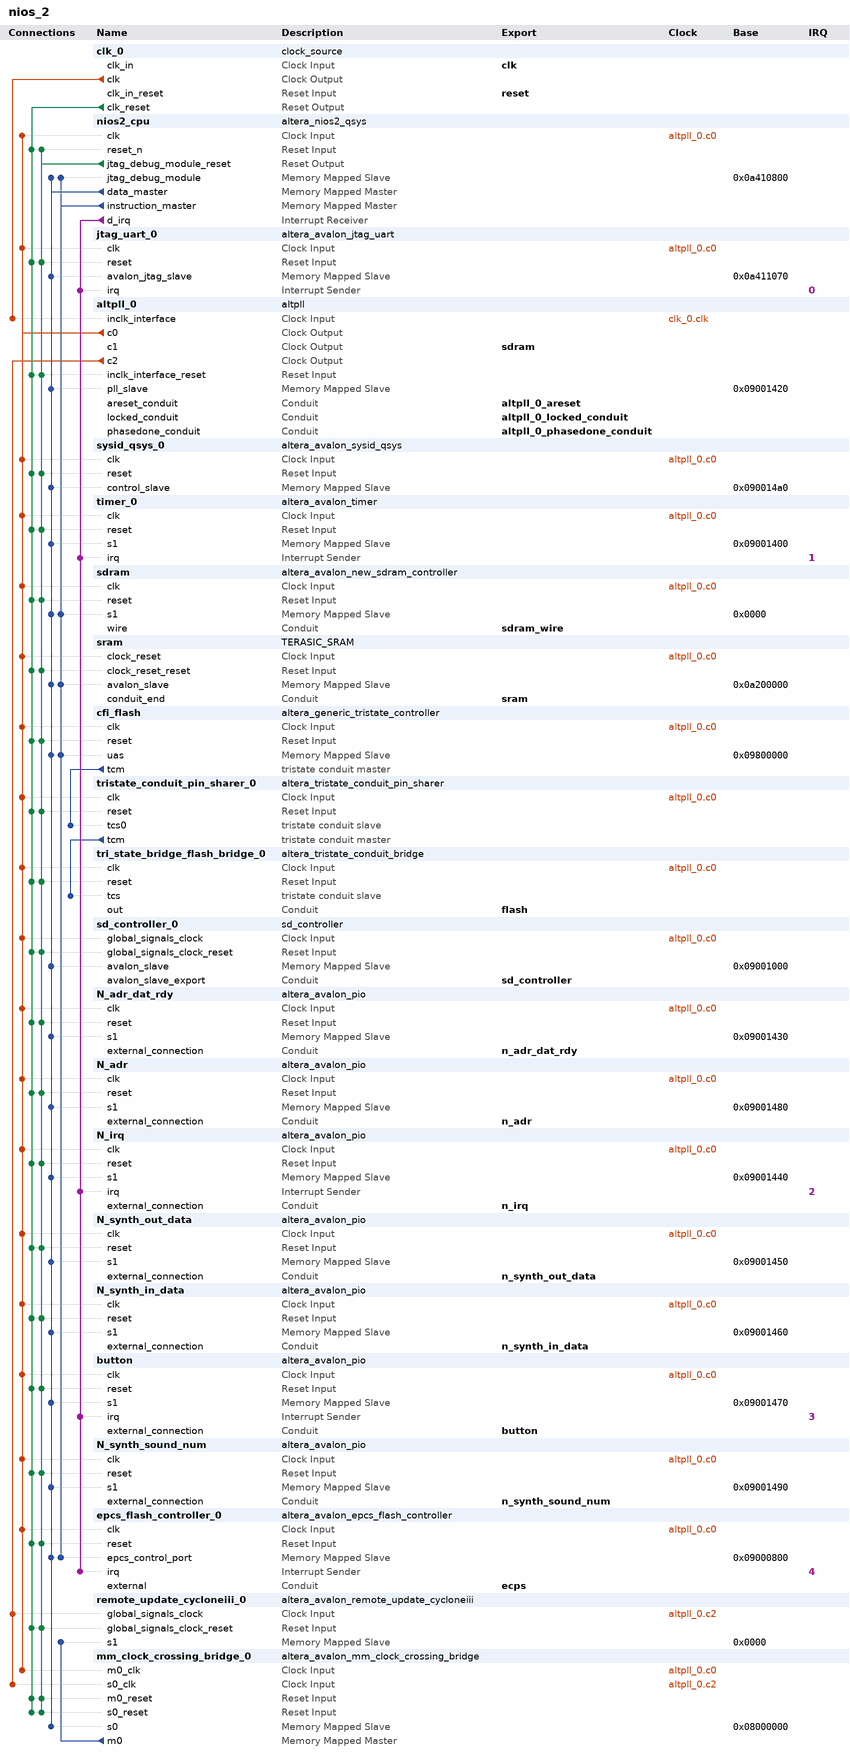
[diagram p0: system contents]
# Platform Designer (Qsys) system nios_2
# Parameters at their usual value, and those the tool derives, are not listed.
package require -exact qsys 11.1
create_system nios_2
set_project_property DEVICE_FAMILY CYCLONEIVE

add_instance clk_0 clock_source 11.1
set_instance_parameter_value clk_0 clockFrequency 50000000

add_instance nios2_cpu altera_nios2_qsys 11.1
set_instance_parameter_value nios2_cpu manuallyAssignCpuID false
set_instance_parameter_value nios2_cpu resetSlave epcs_flash_controller_0.epcs_control_port
set_instance_parameter_value nios2_cpu exceptionSlave sdram.s1
set_instance_parameter_value nios2_cpu breakSlave nios2_cpu.jtag_debug_module
set_instance_parameter_value nios2_cpu impl Fast
set_instance_parameter_value nios2_cpu icache_size 4096

add_instance jtag_uart_0 altera_avalon_jtag_uart 11.1
set_instance_parameter_value jtag_uart_0 simInteractiveOptions INTERACTIVE_ASCII_OUTPUT

add_instance altpll_0 altpll 11.1
set_instance_parameter_value altpll_0 INCLK0_INPUT_FREQUENCY 20000
set_instance_parameter_value altpll_0 CLK0_MULTIPLY_BY 2
set_instance_parameter_value altpll_0 CLK1_MULTIPLY_BY 2
set_instance_parameter_value altpll_0 CLK2_MULTIPLY_BY 4
set_instance_parameter_value altpll_0 CLK0_DIVIDE_BY 1
set_instance_parameter_value altpll_0 CLK1_DIVIDE_BY 1
set_instance_parameter_value altpll_0 CLK2_DIVIDE_BY 5
set_instance_parameter_value altpll_0 CLK1_PHASE_SHIFT -1806
set_instance_parameter_value altpll_0 CLK2_PHASE_SHIFT 0
set_instance_parameter_value altpll_0 CLK1_DUTY_CYCLE 50
set_instance_parameter_value altpll_0 CLK2_DUTY_CYCLE 50
set_instance_parameter_value altpll_0 PORT_clk1 PORT_USED
set_instance_parameter_value altpll_0 PORT_clk2 PORT_USED
set_instance_parameter_value altpll_0 PORT_clk3 PORT_UNUSED
set_instance_parameter_value altpll_0 PORT_ARESET PORT_UNUSED
set_instance_parameter_value altpll_0 PORT_LOCKED PORT_UNUSED

add_instance sysid_qsys_0 altera_avalon_sysid_qsys 11.1
set_instance_parameter_value sysid_qsys_0 id 11

add_instance timer_0 altera_avalon_timer 11.1
set_instance_parameter_value timer_0 period 10
set_instance_parameter_value timer_0 periodUnits MSEC
set_instance_parameter_value timer_0 timerPreset FULL_FEATURED

add_instance sdram altera_avalon_new_sdram_controller 11.1
set_instance_parameter_value sdram TAC 5.5
set_instance_parameter_value sdram TRCD 20.0
set_instance_parameter_value sdram TRP 20.0
set_instance_parameter_value sdram casLatency 3
set_instance_parameter_value sdram columnWidth 10
set_instance_parameter_value sdram dataWidth 32
set_instance_parameter_value sdram generateSimulationModel true
set_instance_parameter_value sdram model custom
set_instance_parameter_value sdram numberOfBanks 4
set_instance_parameter_value sdram numberOfChipSelects 1
set_instance_parameter_value sdram powerUpDelay 100.0
set_instance_parameter_value sdram refreshPeriod 15.625
set_instance_parameter_value sdram rowWidth 13

add_instance sram TERASIC_SRAM 1.0
set_instance_parameter_value sram DATA_BITS 16
set_instance_parameter_value sram ADDR_BITS 20

add_instance cfi_flash altera_generic_tristate_controller 11.1
set_instance_parameter_value cfi_flash TCM_ADDRESS_W 23
set_instance_parameter_value cfi_flash TCM_DATA_W 8
set_instance_parameter_value cfi_flash TCM_BYTEENABLE_W 1
set_instance_parameter_value cfi_flash TCM_READ_WAIT 160
set_instance_parameter_value cfi_flash TCM_WRITE_WAIT 160
set_instance_parameter_value cfi_flash TCM_SETUP_WAIT 60
set_instance_parameter_value cfi_flash TCM_DATA_HOLD 60
set_instance_parameter_value cfi_flash TCM_MAX_PENDING_READ_TRANSACTIONS 3
set_instance_parameter_value cfi_flash TCM_TURNAROUND_TIME 2
set_instance_parameter_value cfi_flash TCM_TIMING_UNITS 0
set_instance_parameter_value cfi_flash TCM_READLATENCY 2
set_instance_parameter_value cfi_flash TCM_SYMBOLS_PER_WORD 1
set_instance_parameter_value cfi_flash USE_READ 1
set_instance_parameter_value cfi_flash USE_BEGINTRANSFER 0
set_instance_parameter_value cfi_flash USE_BYTEENABLE 0
set_instance_parameter_value cfi_flash USE_OUTPUTENABLE 0
set_instance_parameter_value cfi_flash ACTIVE_LOW_READ 1
set_instance_parameter_value cfi_flash ACTIVE_LOW_BYTEENABLE 0
set_instance_parameter_value cfi_flash ACTIVE_LOW_OUTPUTENABLE 0
set_instance_parameter_value cfi_flash ACTIVE_LOW_BEGINTRANSFER 0
set_instance_parameter_value cfi_flash CHIPSELECT_THROUGH_READLATENCY 0
set_instance_parameter_value cfi_flash MODULE_ASSIGNMENT_KEYS embeddedsw.configuration.hwClassnameDriverSupportList,embeddedsw.configuration.hwClassnameDriverSupportDefault,embeddedsw.CMacro.SETUP_VALUE,embeddedsw.CMacro.WAIT_VALUE,embeddedsw.CMacro.HOLD_VALUE,embeddedsw.CMacro.TIMING_UNITS,embeddedsw.CMacro.SIZE,embeddedsw.memoryInfo.MEM_INIT_DATA_WIDTH,embeddedsw.memoryInfo.HAS_BYTE_LANE,embeddedsw.memoryInfo.IS_FLASH,embeddedsw.memoryInfo.GENERATE_DAT_SYM,embeddedsw.memoryInfo.GENERATE_FLASH,embeddedsw.memoryInfo.DAT_SYM_INSTALL_DIR,embeddedsw.memoryInfo.FLASH_INSTALL_DIR
set_instance_parameter_value cfi_flash MODULE_ASSIGNMENT_VALUES altera_avalon_lan91c111:altera_avalon_cfi_flash,altera_avalon_cfi_flash,60,160,60,ns,8388608u,8,0,1,1,1,SIM_DIR,APP_DIR
set_instance_parameter_value cfi_flash INTERFACE_ASSIGNMENT_KEYS embeddedsw.configuration.isFlash,embeddedsw.configuration.isMemoryDevice,embeddedsw.configuration.isNonVolatileStorage
set_instance_parameter_value cfi_flash INTERFACE_ASSIGNMENT_VALUES 1,1,1

add_instance tristate_conduit_pin_sharer_0 altera_tristate_conduit_pin_sharer 11.1
set_instance_parameter_value tristate_conduit_pin_sharer_0 NUM_INTERFACES 1
set_instance_parameter_value tristate_conduit_pin_sharer_0 MODULE_ORIGIN_LIST cfi_flash.tcm,cfi_flash.tcm,cfi_flash.tcm,cfi_flash.tcm,cfi_flash.tcm
set_instance_parameter_value tristate_conduit_pin_sharer_0 SHARED_SIGNAL_LIST tri_state_bridge_flash_address,read_n_to_the_cfi_flash,write_n_to_the_cfi_flash,tri_state_bridge_flash_data,select_n_to_the_cfi_flash

add_instance tri_state_bridge_flash_bridge_0 altera_tristate_conduit_bridge 11.1

add_instance sd_controller_0 sd_controller 8.0
set_instance_parameter_value sd_controller_0 IDLE 0
set_instance_parameter_value sd_controller_0 SHIFT_OUT_CMD 1
set_instance_parameter_value sd_controller_0 WAIT_FOR_RSP_START 2
set_instance_parameter_value sd_controller_0 SHIFT_IN_CMD_RSP 3
set_instance_parameter_value sd_controller_0 WAIT_FOR_DATA_START 4
set_instance_parameter_value sd_controller_0 SHIFT_IN_DATA 5
set_instance_parameter_value sd_controller_0 SHIFT_IN_CRC16 6
set_instance_parameter_value sd_controller_0 SHIFT_OUT_DATA_TOKEN 7
set_instance_parameter_value sd_controller_0 SHIFT_OUT_DATA 8
set_instance_parameter_value sd_controller_0 SHIFT_OUT_CRC16 9
set_instance_parameter_value sd_controller_0 SHIFT_IN_DATA_RSP 10
set_instance_parameter_value sd_controller_0 DATA_BUSY 11
set_instance_parameter_value sd_controller_0 ERROR_STATE 12
set_instance_parameter_value sd_controller_0 WAITS 13

add_instance N_adr_dat_rdy altera_avalon_pio 11.1
set_instance_parameter_value N_adr_dat_rdy direction Output
set_instance_parameter_value N_adr_dat_rdy width 3

add_instance N_adr altera_avalon_pio 11.1
set_instance_parameter_value N_adr direction Output
set_instance_parameter_value N_adr width 10

add_instance N_irq altera_avalon_pio 11.1
set_instance_parameter_value N_irq captureEdge true
set_instance_parameter_value N_irq direction Input
set_instance_parameter_value N_irq generateIRQ true
set_instance_parameter_value N_irq irqType EDGE
set_instance_parameter_value N_irq width 2

add_instance N_synth_out_data altera_avalon_pio 11.1
set_instance_parameter_value N_synth_out_data direction Input
set_instance_parameter_value N_synth_out_data width 8

add_instance N_synth_in_data altera_avalon_pio 11.1
set_instance_parameter_value N_synth_in_data direction Output
set_instance_parameter_value N_synth_in_data width 8

add_instance button altera_avalon_pio 11.1
set_instance_parameter_value button captureEdge true
set_instance_parameter_value button direction Input
set_instance_parameter_value button generateIRQ true
set_instance_parameter_value button irqType EDGE
set_instance_parameter_value button width 4

add_instance N_synth_sound_num altera_avalon_pio 11.1
set_instance_parameter_value N_synth_sound_num captureEdge true
set_instance_parameter_value N_synth_sound_num direction Input
set_instance_parameter_value N_synth_sound_num width 8

add_instance epcs_flash_controller_0 altera_avalon_epcs_flash_controller 11.1

add_instance remote_update_cycloneiii_0 altera_avalon_remote_update_cycloneiii 11.1
set_instance_parameter_value remote_update_cycloneiii_0 clockFrequency 40000000

add_instance mm_clock_crossing_bridge_0 altera_avalon_mm_clock_crossing_bridge 11.1
set_instance_parameter_value mm_clock_crossing_bridge_0 DATA_WIDTH 32
set_instance_parameter_value mm_clock_crossing_bridge_0 ADDRESS_WIDTH 10
set_instance_parameter_value mm_clock_crossing_bridge_0 MAX_BURST_SIZE 1
set_instance_parameter_value mm_clock_crossing_bridge_0 COMMAND_FIFO_DEPTH 4
set_instance_parameter_value mm_clock_crossing_bridge_0 RESPONSE_FIFO_DEPTH 4
set_instance_parameter_value mm_clock_crossing_bridge_0 MASTER_SYNC_DEPTH 2
set_instance_parameter_value mm_clock_crossing_bridge_0 SLAVE_SYNC_DEPTH 2

# connections
add_connection altpll_0.c0 button.clk clock
add_connection altpll_0.c0 cfi_flash.clk clock
add_connection altpll_0.c0 epcs_flash_controller_0.clk clock
add_connection altpll_0.c0 jtag_uart_0.clk clock
add_connection altpll_0.c0 mm_clock_crossing_bridge_0.m0_clk clock
add_connection altpll_0.c0 N_adr.clk clock
add_connection altpll_0.c0 N_adr_dat_rdy.clk clock
add_connection altpll_0.c0 N_irq.clk clock
add_connection altpll_0.c0 N_synth_in_data.clk clock
add_connection altpll_0.c0 N_synth_out_data.clk clock
add_connection altpll_0.c0 N_synth_sound_num.clk clock
add_connection altpll_0.c0 nios2_cpu.clk clock
add_connection altpll_0.c0 sd_controller_0.global_signals_clock clock
add_connection altpll_0.c0 sdram.clk clock
add_connection altpll_0.c0 sram.clock_reset clock
add_connection altpll_0.c0 sysid_qsys_0.clk clock
add_connection altpll_0.c0 timer_0.clk clock
add_connection altpll_0.c0 tri_state_bridge_flash_bridge_0.clk clock
add_connection altpll_0.c0 tristate_conduit_pin_sharer_0.clk clock
add_connection altpll_0.c2 mm_clock_crossing_bridge_0.s0_clk clock
add_connection altpll_0.c2 remote_update_cycloneiii_0.global_signals_clock clock
add_connection clk_0.clk altpll_0.inclk_interface clock
add_connection clk_0.clk_reset altpll_0.inclk_interface_reset reset
add_connection clk_0.clk_reset button.reset reset
add_connection clk_0.clk_reset cfi_flash.reset reset
add_connection clk_0.clk_reset epcs_flash_controller_0.reset reset
add_connection clk_0.clk_reset jtag_uart_0.reset reset
add_connection clk_0.clk_reset mm_clock_crossing_bridge_0.m0_reset reset
add_connection clk_0.clk_reset mm_clock_crossing_bridge_0.s0_reset reset
add_connection clk_0.clk_reset N_adr.reset reset
add_connection clk_0.clk_reset N_adr_dat_rdy.reset reset
add_connection clk_0.clk_reset N_irq.reset reset
add_connection clk_0.clk_reset N_synth_in_data.reset reset
add_connection clk_0.clk_reset N_synth_out_data.reset reset
add_connection clk_0.clk_reset N_synth_sound_num.reset reset
add_connection clk_0.clk_reset nios2_cpu.reset_n reset
add_connection clk_0.clk_reset remote_update_cycloneiii_0.global_signals_clock_reset reset
add_connection clk_0.clk_reset sd_controller_0.global_signals_clock_reset reset
add_connection clk_0.clk_reset sdram.reset reset
add_connection clk_0.clk_reset sram.clock_reset_reset reset
add_connection clk_0.clk_reset sysid_qsys_0.reset reset
add_connection clk_0.clk_reset timer_0.reset reset
add_connection clk_0.clk_reset tri_state_bridge_flash_bridge_0.reset reset
add_connection clk_0.clk_reset tristate_conduit_pin_sharer_0.reset reset
add_connection nios2_cpu.jtag_debug_module_reset altpll_0.inclk_interface_reset reset
add_connection nios2_cpu.jtag_debug_module_reset button.reset reset
add_connection nios2_cpu.jtag_debug_module_reset cfi_flash.reset reset
add_connection nios2_cpu.jtag_debug_module_reset epcs_flash_controller_0.reset reset
add_connection nios2_cpu.jtag_debug_module_reset jtag_uart_0.reset reset
add_connection nios2_cpu.jtag_debug_module_reset mm_clock_crossing_bridge_0.m0_reset reset
add_connection nios2_cpu.jtag_debug_module_reset mm_clock_crossing_bridge_0.s0_reset reset
add_connection nios2_cpu.jtag_debug_module_reset N_adr.reset reset
add_connection nios2_cpu.jtag_debug_module_reset N_adr_dat_rdy.reset reset
add_connection nios2_cpu.jtag_debug_module_reset N_irq.reset reset
add_connection nios2_cpu.jtag_debug_module_reset N_synth_in_data.reset reset
add_connection nios2_cpu.jtag_debug_module_reset N_synth_out_data.reset reset
add_connection nios2_cpu.jtag_debug_module_reset N_synth_sound_num.reset reset
add_connection nios2_cpu.jtag_debug_module_reset nios2_cpu.reset_n reset
add_connection nios2_cpu.jtag_debug_module_reset remote_update_cycloneiii_0.global_signals_clock_reset reset
add_connection nios2_cpu.jtag_debug_module_reset sd_controller_0.global_signals_clock_reset reset
add_connection nios2_cpu.jtag_debug_module_reset sdram.reset reset
add_connection nios2_cpu.jtag_debug_module_reset sram.clock_reset_reset reset
add_connection nios2_cpu.jtag_debug_module_reset sysid_qsys_0.reset reset
add_connection nios2_cpu.jtag_debug_module_reset timer_0.reset reset
add_connection nios2_cpu.jtag_debug_module_reset tri_state_bridge_flash_bridge_0.reset reset
add_connection nios2_cpu.jtag_debug_module_reset tristate_conduit_pin_sharer_0.reset reset
add_connection mm_clock_crossing_bridge_0.m0 remote_update_cycloneiii_0.s1 avalon
set_connection_parameter_value mm_clock_crossing_bridge_0.m0/remote_update_cycloneiii_0.s1 baseAddress 0x0000
add_connection nios2_cpu.data_master altpll_0.pll_slave avalon
set_connection_parameter_value nios2_cpu.data_master/altpll_0.pll_slave baseAddress 0x09001420
add_connection nios2_cpu.data_master button.s1 avalon
set_connection_parameter_value nios2_cpu.data_master/button.s1 baseAddress 0x09001470
add_connection nios2_cpu.data_master cfi_flash.uas avalon
set_connection_parameter_value nios2_cpu.data_master/cfi_flash.uas baseAddress 0x09800000
add_connection nios2_cpu.data_master epcs_flash_controller_0.epcs_control_port avalon
set_connection_parameter_value nios2_cpu.data_master/epcs_flash_controller_0.epcs_control_port baseAddress 0x09000800
add_connection nios2_cpu.data_master jtag_uart_0.avalon_jtag_slave avalon
set_connection_parameter_value nios2_cpu.data_master/jtag_uart_0.avalon_jtag_slave baseAddress 0x0a411070
add_connection nios2_cpu.data_master mm_clock_crossing_bridge_0.s0 avalon
set_connection_parameter_value nios2_cpu.data_master/mm_clock_crossing_bridge_0.s0 baseAddress 0x08000000
add_connection nios2_cpu.data_master N_adr.s1 avalon
set_connection_parameter_value nios2_cpu.data_master/N_adr.s1 baseAddress 0x09001480
add_connection nios2_cpu.data_master N_adr_dat_rdy.s1 avalon
set_connection_parameter_value nios2_cpu.data_master/N_adr_dat_rdy.s1 baseAddress 0x09001430
add_connection nios2_cpu.data_master N_irq.s1 avalon
set_connection_parameter_value nios2_cpu.data_master/N_irq.s1 baseAddress 0x09001440
add_connection nios2_cpu.data_master N_synth_in_data.s1 avalon
set_connection_parameter_value nios2_cpu.data_master/N_synth_in_data.s1 baseAddress 0x09001460
add_connection nios2_cpu.data_master N_synth_out_data.s1 avalon
set_connection_parameter_value nios2_cpu.data_master/N_synth_out_data.s1 baseAddress 0x09001450
add_connection nios2_cpu.data_master N_synth_sound_num.s1 avalon
set_connection_parameter_value nios2_cpu.data_master/N_synth_sound_num.s1 baseAddress 0x09001490
add_connection nios2_cpu.data_master nios2_cpu.jtag_debug_module avalon
set_connection_parameter_value nios2_cpu.data_master/nios2_cpu.jtag_debug_module baseAddress 0x0a410800
add_connection nios2_cpu.data_master sd_controller_0.avalon_slave avalon
set_connection_parameter_value nios2_cpu.data_master/sd_controller_0.avalon_slave baseAddress 0x09001000
add_connection nios2_cpu.data_master sdram.s1 avalon
set_connection_parameter_value nios2_cpu.data_master/sdram.s1 baseAddress 0x0000
add_connection nios2_cpu.data_master sram.avalon_slave avalon
set_connection_parameter_value nios2_cpu.data_master/sram.avalon_slave baseAddress 0x0a200000
add_connection nios2_cpu.data_master sysid_qsys_0.control_slave avalon
set_connection_parameter_value nios2_cpu.data_master/sysid_qsys_0.control_slave baseAddress 0x090014a0
add_connection nios2_cpu.data_master timer_0.s1 avalon
set_connection_parameter_value nios2_cpu.data_master/timer_0.s1 baseAddress 0x09001400
add_connection nios2_cpu.instruction_master cfi_flash.uas avalon
set_connection_parameter_value nios2_cpu.instruction_master/cfi_flash.uas baseAddress 0x09800000
add_connection nios2_cpu.instruction_master epcs_flash_controller_0.epcs_control_port avalon
set_connection_parameter_value nios2_cpu.instruction_master/epcs_flash_controller_0.epcs_control_port baseAddress 0x09000800
add_connection nios2_cpu.instruction_master nios2_cpu.jtag_debug_module avalon
set_connection_parameter_value nios2_cpu.instruction_master/nios2_cpu.jtag_debug_module baseAddress 0x0a410800
add_connection nios2_cpu.instruction_master sdram.s1 avalon
set_connection_parameter_value nios2_cpu.instruction_master/sdram.s1 baseAddress 0x0000
add_connection nios2_cpu.instruction_master sram.avalon_slave avalon
set_connection_parameter_value nios2_cpu.instruction_master/sram.avalon_slave baseAddress 0x0a200000
add_connection nios2_cpu.d_irq button.irq interrupt
set_connection_parameter_value nios2_cpu.d_irq/button.irq irqNumber 3
add_connection nios2_cpu.d_irq epcs_flash_controller_0.irq interrupt
set_connection_parameter_value nios2_cpu.d_irq/epcs_flash_controller_0.irq irqNumber 4
add_connection nios2_cpu.d_irq jtag_uart_0.irq interrupt
set_connection_parameter_value nios2_cpu.d_irq/jtag_uart_0.irq irqNumber 0
add_connection nios2_cpu.d_irq N_irq.irq interrupt
set_connection_parameter_value nios2_cpu.d_irq/N_irq.irq irqNumber 2
add_connection nios2_cpu.d_irq timer_0.irq interrupt
set_connection_parameter_value nios2_cpu.d_irq/timer_0.irq irqNumber 1
add_connection cfi_flash.tcm tristate_conduit_pin_sharer_0.tcs0 tristate_conduit
add_connection tristate_conduit_pin_sharer_0.tcm tri_state_bridge_flash_bridge_0.tcs tristate_conduit

# exported interfaces
add_interface clk clock sink
set_interface_property clk EXPORT_OF clk_0.clk_in
add_interface sram conduit end
set_interface_property sram EXPORT_OF sram.conduit_end
add_interface n_irq conduit end
set_interface_property n_irq EXPORT_OF N_irq.external_connection
add_interface n_adr conduit end
set_interface_property n_adr EXPORT_OF N_adr.external_connection
add_interface n_adr_dat_rdy conduit end
set_interface_property n_adr_dat_rdy EXPORT_OF N_adr_dat_rdy.external_connection
add_interface sd_controller conduit end
set_interface_property sd_controller EXPORT_OF sd_controller_0.avalon_slave_export
add_interface n_synth_out_data conduit end
set_interface_property n_synth_out_data EXPORT_OF N_synth_out_data.external_connection
add_interface n_synth_in_data conduit end
set_interface_property n_synth_in_data EXPORT_OF N_synth_in_data.external_connection
add_interface flash conduit end
set_interface_property flash EXPORT_OF tri_state_bridge_flash_bridge_0.out
add_interface button conduit end
set_interface_property button EXPORT_OF button.external_connection
add_interface n_synth_sound_num conduit end
set_interface_property n_synth_sound_num EXPORT_OF N_synth_sound_num.external_connection
add_interface reset reset sink
set_interface_property reset EXPORT_OF clk_0.clk_in_reset
add_interface altpll_0_areset conduit end
set_interface_property altpll_0_areset EXPORT_OF altpll_0.areset_conduit
add_interface sdram_wire conduit end
set_interface_property sdram_wire EXPORT_OF sdram.wire
add_interface sdram clock source
set_interface_property sdram EXPORT_OF altpll_0.c1
add_interface altpll_0_locked_conduit conduit end
set_interface_property altpll_0_locked_conduit EXPORT_OF altpll_0.locked_conduit
add_interface altpll_0_phasedone_conduit conduit end
set_interface_property altpll_0_phasedone_conduit EXPORT_OF altpll_0.phasedone_conduit
add_interface ecps conduit end
set_interface_property ecps EXPORT_OF epcs_flash_controller_0.external

save_system nios_2.qsys
